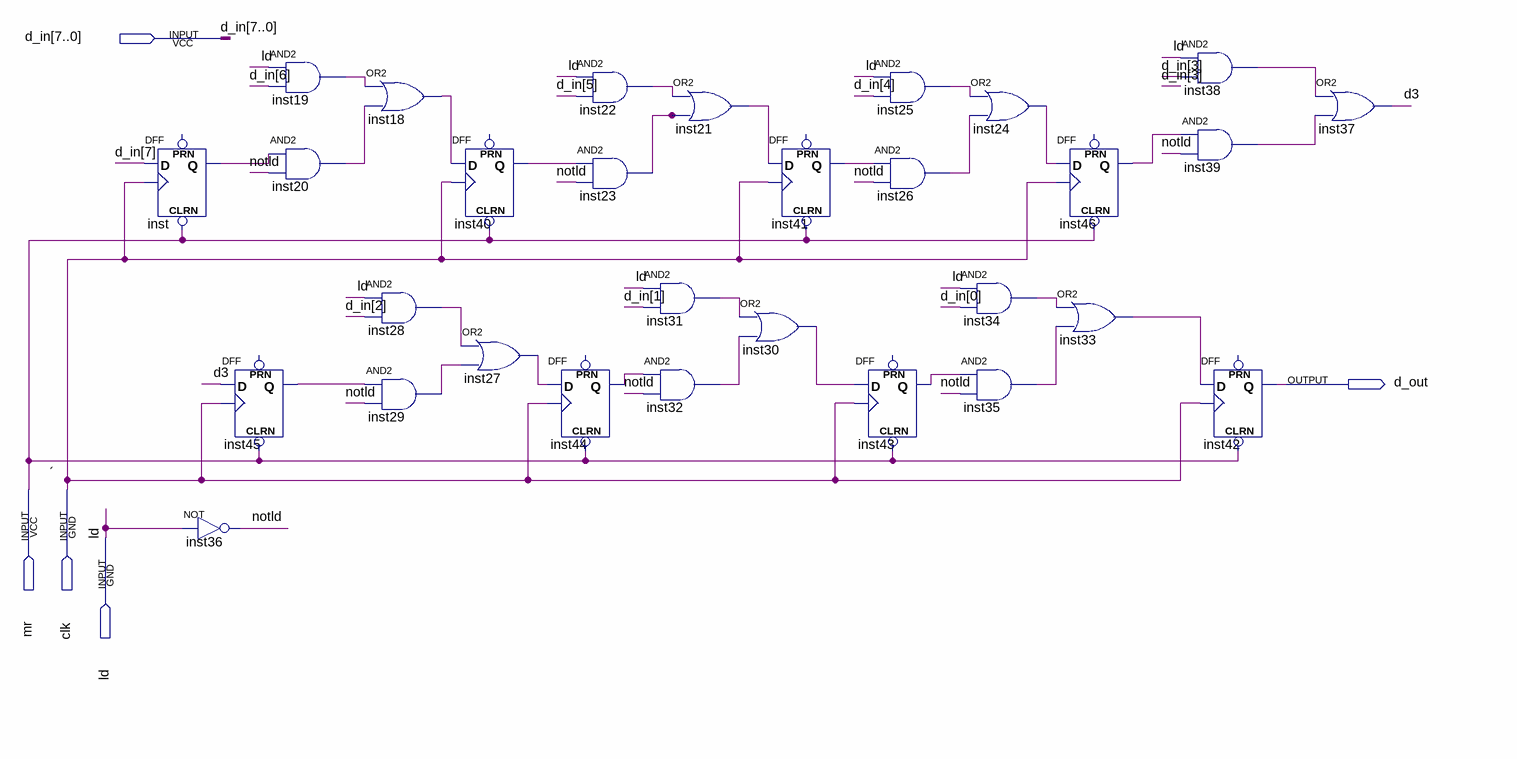
[diagram p0: schematic sheet]
// Quartus schematic sh_reg_piso_8b.bdf as structural Verilog: 30 symbols, 5 pins
module sh_reg_piso_8b (
  input  [7:0] d_in,
  input  mr,
  input  clk,
  input  ld,
  output d_out
);

  wire d3, inst18_out, inst19_out, inst20_out, inst21_out, inst22_out, inst23_out, inst24_out, inst25_out,
       inst26_out, inst27_out, inst28_out, inst29_out, inst30_out, inst31_out, inst32_out, inst33_out,
       inst34_out, inst35_out, inst38_out, inst39_out, inst40_q, inst41_q, inst43_q, inst44_q, inst45_q,
       inst46_q, inst_q, notld;

  DFF inst (.CLRN(mr), .CLK(clk), .D(d_in[7]), .Q(inst_q));  // open: PRN
  not inst36 (notld, ld);
  and inst19 (inst19_out, ld, d_in[6]);
  and inst20 (inst20_out, inst_q, notld);
  DFF inst45 (.CLRN(mr), .CLK(clk), .D(d3), .Q(inst45_q));  // open: PRN
  or inst18 (inst18_out, inst19_out, inst20_out);
  and inst28 (inst28_out, ld, d_in[2]);
  and inst29 (inst29_out, inst45_q, notld);
  DFF inst40 (.CLRN(mr), .CLK(clk), .D(inst18_out), .Q(inst40_q));  // open: PRN
  or inst27 (inst27_out, inst28_out, inst29_out);
  and inst22 (inst22_out, ld, d_in[5]);
  and inst23 (inst23_out, inst40_q, notld);
  DFF inst44 (.CLRN(mr), .CLK(clk), .D(inst27_out), .Q(inst44_q));  // open: PRN
  and inst31 (inst31_out, ld, d_in[1]);
  and inst32 (inst32_out, inst44_q, notld);
  or inst21 (inst21_out, inst22_out, inst23_out);
  or inst30 (inst30_out, inst31_out, inst32_out);
  DFF inst41 (.CLRN(mr), .CLK(clk), .D(inst21_out), .Q(inst41_q));  // open: PRN
  and inst25 (inst25_out, ld, d_in[4]);
  and inst26 (inst26_out, inst41_q, notld);
  DFF inst43 (.CLRN(mr), .CLK(clk), .D(inst30_out), .Q(inst43_q));  // open: PRN
  or inst24 (inst24_out, inst25_out, inst26_out);
  and inst34 (inst34_out, ld, d_in[0]);
  and inst35 (inst35_out, inst43_q, notld);
  DFF inst46 (.CLRN(mr), .CLK(clk), .D(inst24_out), .Q(inst46_q));  // open: PRN
  or inst33 (inst33_out, inst34_out, inst35_out);
  and inst38 (inst38_out, ld, d_in[3]);
  and inst39 (inst39_out, inst46_q, notld);
  DFF inst42 (.CLRN(mr), .CLK(clk), .D(inst33_out), .Q(d_out));  // open: PRN
  or inst37 (d3, inst38_out, inst39_out);

  // Other names for the same wires on the sheet: ` = clk
endmodule
